# Altium schematic sheet contactor_control.SchDoc: foxBMS BMS-Master
size A3; DocumentNumber: 16; SheetNumber: 16; SheetTotal: 24; Author: Fraunhofer IISB foxBMS Team; REL-DATE: 2017-05-16; VERSION: 1.0.2; SheetDescription: Contactor Control
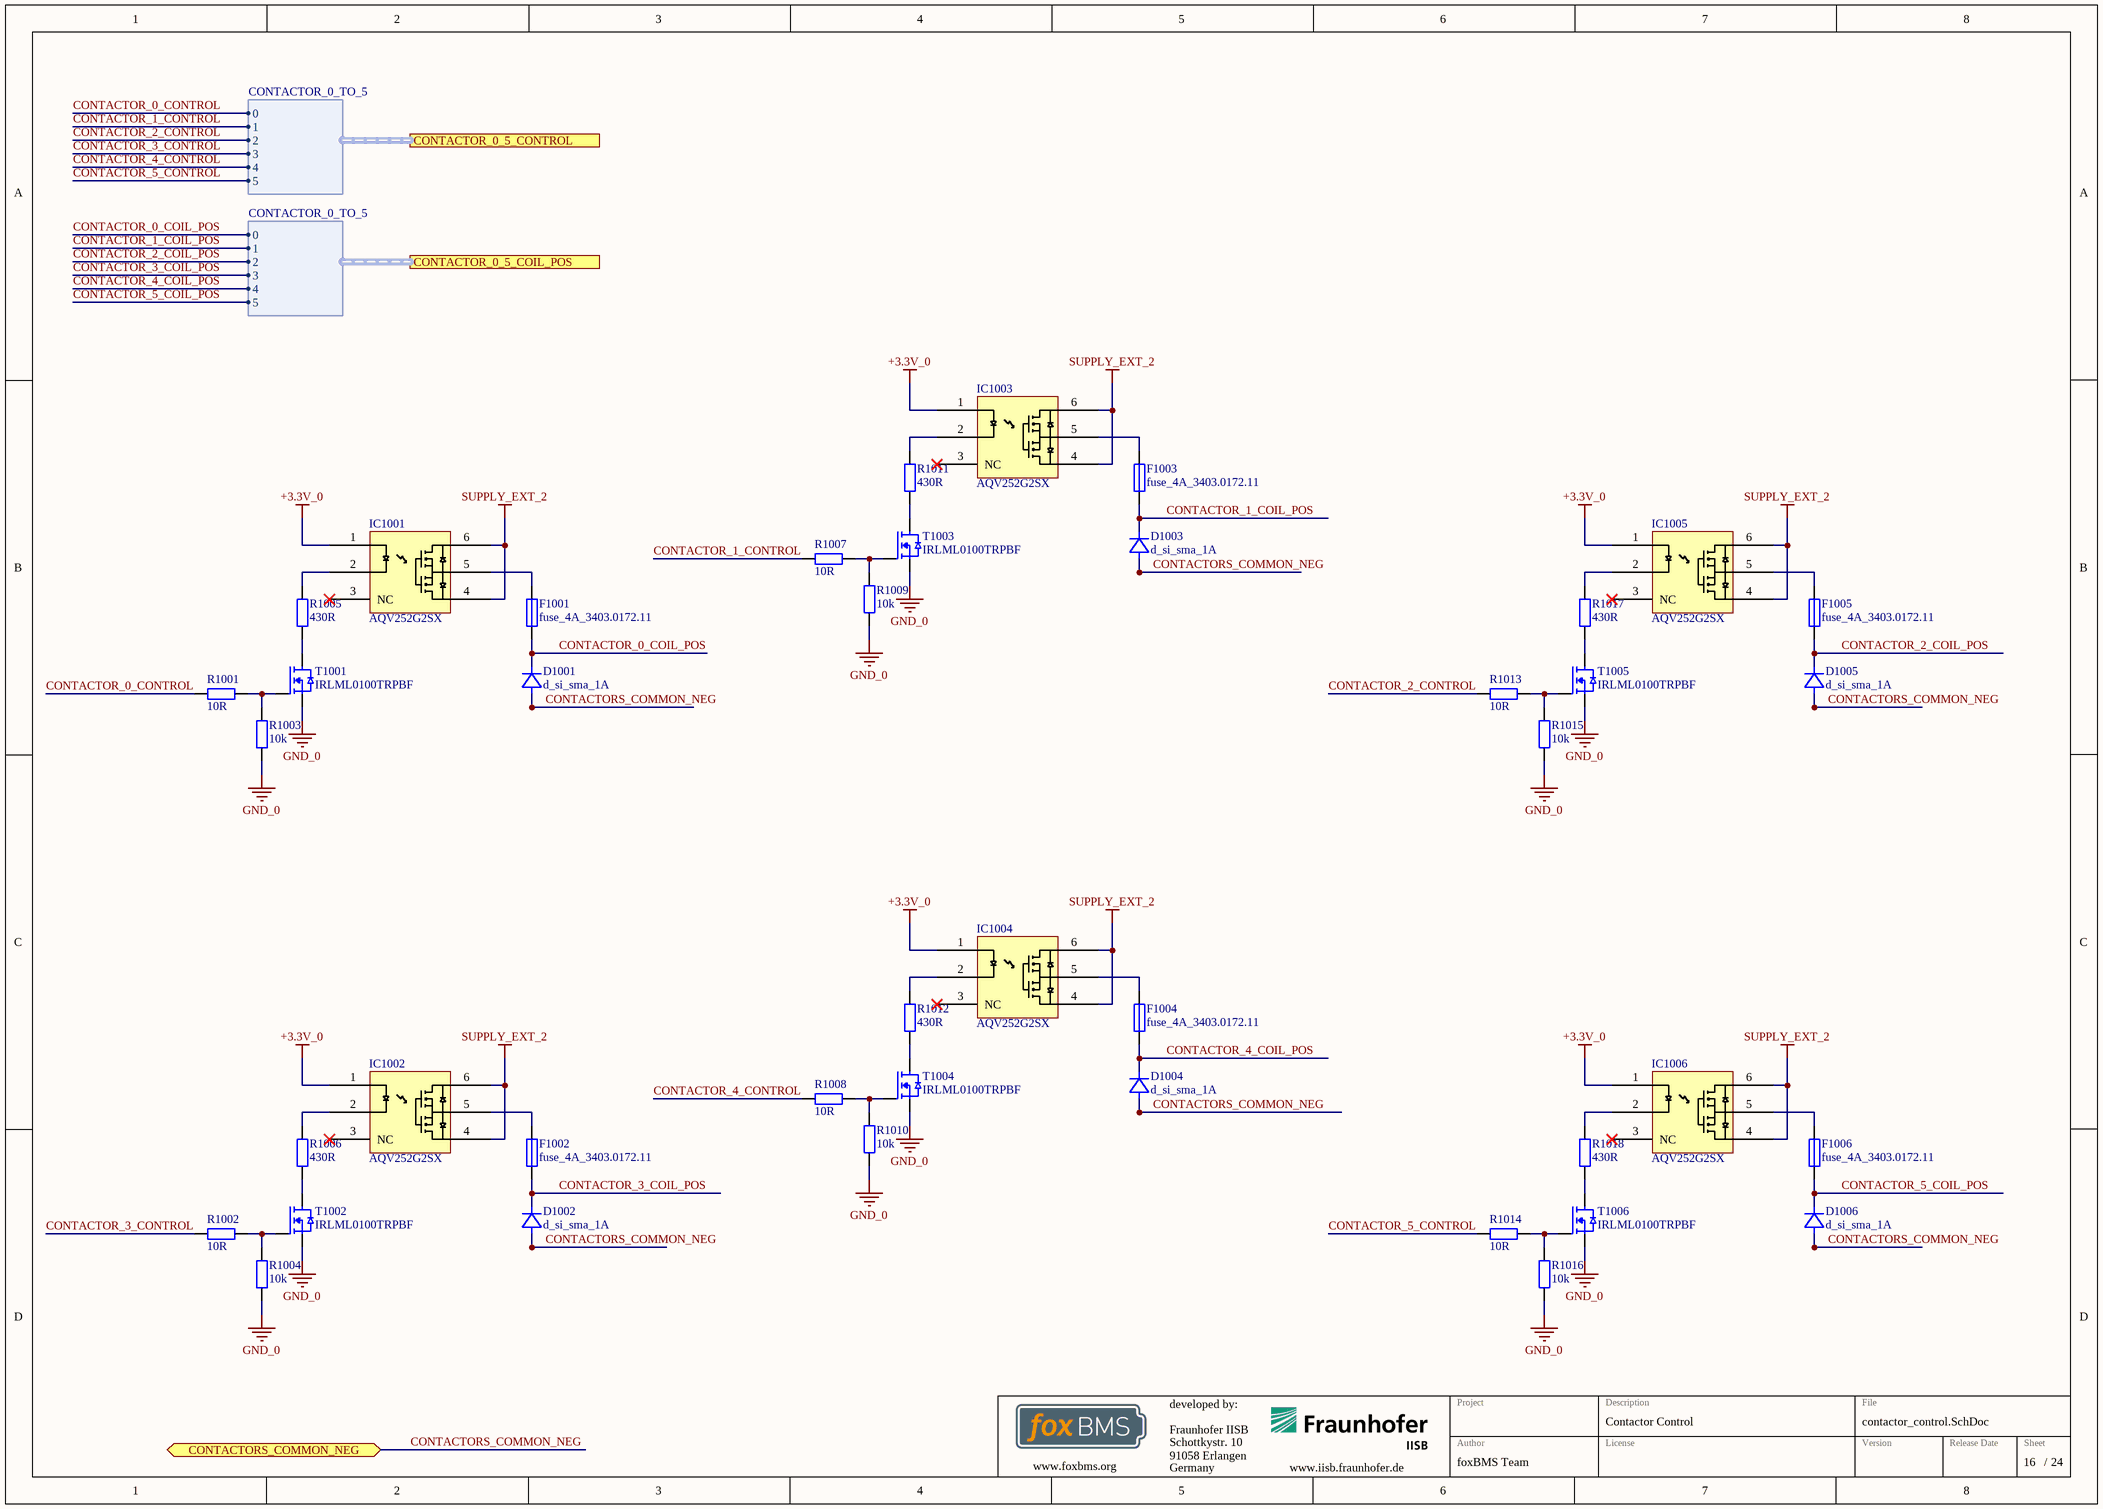
[diagram p0: contactor_control.SchDoc]

## Parts
D1001  d_si_sma_1A  [DIOM4326X24N]
D1002  d_si_sma_1A  [DIOM4326X24N]
D1003  d_si_sma_1A  [DIOM4326X24N]
D1004  d_si_sma_1A  [DIOM4326X24N]
D1005  d_si_sma_1A  [DIOM4326X24N]
D1006  d_si_sma_1A  [DIOM4326X24N]
F1001  fuse_4A_3403.0172.11  [Schurter_UMT_250]
F1002  fuse_4A_3403.0172.11  [Schurter_UMT_250]
F1003  fuse_4A_3403.0172.11  [Schurter_UMT_250]
F1004  fuse_4A_3403.0172.11  [Schurter_UMT_250]
F1005  fuse_4A_3403.0172.11  [Schurter_UMT_250]
F1006  fuse_4A_3403.0172.11  [Schurter_UMT_250]
IC1001  AQV252G2SX  [SOP254P680X220-6N]
IC1002  AQV252G2SX  [SOP254P680X220-6N]
IC1003  AQV252G2SX  [SOP254P680X220-6N]
IC1004  AQV252G2SX  [SOP254P680X220-6N]
IC1005  AQV252G2SX  [SOP254P680X220-6N]
IC1006  AQV252G2SX  [SOP254P680X220-6N]
R1001  10R  [RESC1608X05N]
R1002  10R  [RESC1608X05N]
R1003  10k  [RESC1608X05N]
R1004  10k  [RESC1608X05N]
R1005  430R  [RESC1608X05N]
R1006  430R  [RESC1608X05N]
R1007  10R  [RESC1608X05N]
R1008  10R  [RESC1608X05N]
R1009  10k  [RESC1608X05N]
R1010  10k  [RESC1608X05N]
R1011  430R  [RESC1608X05N]
R1012  430R  [RESC1608X05N]
R1013  10R  [RESC1608X05N]
R1014  10R  [RESC1608X05N]
R1015  10k  [RESC1608X05N]
R1016  10k  [RESC1608X05N]
R1017  430R  [RESC1608X05N]
R1018  430R  [RESC1608X05N]
T1001  IRLML0100TRPBF  [SOT95P237X110-3N]
T1002  IRLML0100TRPBF  [SOT95P237X110-3N]
T1003  IRLML0100TRPBF  [SOT95P237X110-3N]
T1004  IRLML0100TRPBF  [SOT95P237X110-3N]
T1005  IRLML0100TRPBF  [SOT95P237X110-3N]
T1006  IRLML0100TRPBF  [SOT95P237X110-3N]

## Ports
CONTACTOR_0_5_COIL_POS (harness CONTACTOR_0_TO_5), CONTACTOR_0_5_CONTROL (harness CONTACTOR_0_TO_5), CONTACTORS_COMMON_NEG (bidir)

## Harnesses
CONTACTOR_0_TO_5: 0, 1, 2, 3, 4, 5

## Nets
+3.3V_0: IC1001.1 IC1002.1 IC1003.1 IC1004.1 IC1005.1 IC1006.1
GND_0: R1003.1 R1004.1 R1009.1 R1010.1 R1015.1 R1016.1 T1001.S T1002.S T1003.S T1004.S T1005.S T1006.S
SUPPLY_EXT_2: IC1001.4 IC1001.6 IC1002.4 IC1002.6 IC1003.4 IC1003.6 IC1004.4 IC1004.6 IC1005.4 IC1005.6 IC1006.4 IC1006.6
CONTACTOR_0_COIL_POS: D1001.1(K) F1001.2 ; port CONTACTOR_0_5_COIL_POS.0
CONTACTOR_0_CONTROL: R1001.2 ; port CONTACTOR_0_5_CONTROL.0
CONTACTOR_1_COIL_POS: D1003.1(K) F1003.2 ; port CONTACTOR_0_5_COIL_POS.1
CONTACTOR_1_CONTROL: R1007.2 ; port CONTACTOR_0_5_CONTROL.1
CONTACTOR_2_COIL_POS: D1005.1(K) F1005.2 ; port CONTACTOR_0_5_COIL_POS.2
CONTACTOR_2_CONTROL: R1013.2 ; port CONTACTOR_0_5_CONTROL.2
CONTACTOR_3_COIL_POS: D1002.1(K) F1002.2 ; port CONTACTOR_0_5_COIL_POS.3
CONTACTOR_3_CONTROL: R1002.2 ; port CONTACTOR_0_5_CONTROL.3
CONTACTOR_4_COIL_POS: D1004.1(K) F1004.2 ; port CONTACTOR_0_5_COIL_POS.4
CONTACTOR_4_CONTROL: R1008.2 ; port CONTACTOR_0_5_CONTROL.4
CONTACTOR_5_COIL_POS: D1006.1(K) F1006.2 ; port CONTACTOR_0_5_COIL_POS.5
CONTACTOR_5_CONTROL: R1014.2 ; port CONTACTOR_0_5_CONTROL.5
CONTACTORS_COMMON_NEG: D1001.2(A) D1002.2(A) D1003.2(A) D1004.2(A) D1005.2(A) D1006.2(A) ; port CONTACTORS_COMMON_NEG
NetF1001_1: F1001.1 IC1001.5
NetF1002_1: F1002.1 IC1002.5
NetF1003_1: F1003.1 IC1003.5
NetF1004_1: F1004.1 IC1004.5
NetF1005_1: F1005.1 IC1005.5
NetF1006_1: F1006.1 IC1006.5
NetIC1001_2: IC1001.2 R1005.2
NetIC1002_2: IC1002.2 R1006.2
NetIC1003_2: IC1003.2 R1011.2
NetIC1004_2: IC1004.2 R1012.2
NetIC1005_2: IC1005.2 R1017.2
NetIC1006_2: IC1006.2 R1018.2
NetR1001_1: R1001.1 R1003.2 T1001.G
NetR1002_1: R1002.1 R1004.2 T1002.G
NetR1005_1: R1005.1 T1001.D
NetR1006_1: R1006.1 T1002.D
NetR1007_1: R1007.1 R1009.2 T1003.G
NetR1008_1: R1008.1 R1010.2 T1004.G
NetR1011_1: R1011.1 T1003.D
NetR1012_1: R1012.1 T1004.D
NetR1013_1: R1013.1 R1015.2 T1005.G
NetR1014_1: R1014.1 R1016.2 T1006.G
NetR1017_1: R1017.1 T1005.D
NetR1018_1: R1018.1 T1006.D

Not connected (* = marked no-connect by the designer): IC1001 3(NC)*; IC1002 3(NC)*; IC1003 3(NC)*; IC1004 3(NC)*; IC1005 3(NC)*; IC1006 3(NC)*

## Notes on the sheet
- Fraunhofer IISB
- Schottkystr. 10
- developed by:
- 91058 Erlangen
- Germany
- Author
- Project
- License
- Description
- File
- Version
- Release Date
- Sheet
- www.foxbms.org
- www.iisb.fraunhofer.de
- foxBMS Team
- /

## Library data of the parts
D1001-D1006 = d_si_sma_1A: Standard Recovery Diode, 100 V, 1 A, Single, 1 V, 2 µs, 30 A; Part Name: GF1B; Manufacturer: ON Semiconductor; Breakdown Voltage: 100V; Continuous Forward Current: 1A; Automotive Qualified: False; Part Number: d_si_sma_1A; Operating Temperature: -65°C - +175°C; ComponentLink1Description: Datasheet; ComponentLink1URL: http://www.farnell.com/datasheets/2303965.pdf; Supplier 1: Farnell; Supplier Part Number 1: 1467477
F1001-F1006 = fuse_4A_3403.0172.11: Schurter SMD Fuse 4.0A UMT 3403.0172.11; Automotive Qualified: False; Part Number: fuse_4A_3403.0172.11; Manufacturer: Schurter; Operating Temperature: -55°C - +125°C; ComponentLink1Description: Catalog Page Digikey; ComponentLink1URL: http://dkc3.digikey.com/PDF/DE2011-DE/P2352.pdf; Supplier 1: Digikey; Supplier Part Number 1: 486-1253-ND; Supplier 2: Mouser; Supplier Part Number 2: 693-3403.0172.11
IC1001-IC1006 = AQV252G2SX: PhotoMOS Relay; Manufacturer: Panasonic; Automotive Qualified: False; Part Number: AQV252G2SX; Part Name: AQV252G2SX; Operating Temperature: -40°C - +85°C; Supplier 1: Digikey; Supplier Part Number 1: 255-3594-1-ND; Supplier 2: Farnell; Supplier Part Number 2: 2302216
R1001 R1002 R1007 R1008 R1013 R1014 = gen_R_10R_0603: SMD Resistor 10R 0603; Tolerance: 1%; Power: 0.1W; Case EIA: 0603; Case Metric: 1608; Maximum Working Voltage: 75V; PnP Package: R_0603; Automotive Qualified: False; Part Number: gen_R_10R_0603; Operating Temperature: -55°C - +155°C; Resistance: 10R; Series: E24, E96; PnP Value: 10R; Supplier 1: Farnell; Supplier Part Number 1: 2073361
R1003 R1004 R1009 R1010 R1015 R1016 = gen_R_10k_0603: SMD Resistor 10k 0603; Tolerance: 1%; Power: 0.1W; Case EIA: 0603; Case Metric: 1608; Maximum Working Voltage: 75V; PnP Package: R_0603; Automotive Qualified: False; Part Number: gen_R_10k_0603; Operating Temperature: -55°C - +155°C; Resistance: 10k; Series: E24, E96; PnP Value: 10k; Supplier 1: Farnell; Supplier Part Number 1: 2073349
R1005 R1006 R1011 R1012 R1017 R1018 = gen_R_430R_0603: SMD Resistor 430R 0603; Tolerance: 1%; Power: 0.1W; Case EIA: 0603; Case Metric: 1608; Maximum Working Voltage: 75V; PnP Package: R_0603; Automotive Qualified: False; Part Number: gen_R_430R_0603; Operating Temperature: -55°C - +155°C; Resistance: 430R; Series: E24; PnP Value: 430R; Supplier 1: Farnell; Supplier Part Number 1: 2074259
T1001-T1006 = IRLML0100TRPBF: MOSFET-Transistor, n-Kanal, 1.6 A, 100 V, 0.178 ohm, 10 V, 2.5 V; Manufacturer: Infineon; Maximum Drain-Source Voltage: 100V; Maximum Continous Drain Current (25°C): 1.6A; R_DS(on): 190m; Total Gate Charge: 2.5nC; Automotive Qualified: False; Part Number: IRLML0100TRPBF; Part Name: NMOS; Operating Temperature: -55°C - +150°C; ComponentLink1Description: Datasheet URL; ComponentLink1URL: http://www.farnell.com/datasheets/491501.pdf; Supplier 1: Farnell; Supplier Part Number 1: 1783928